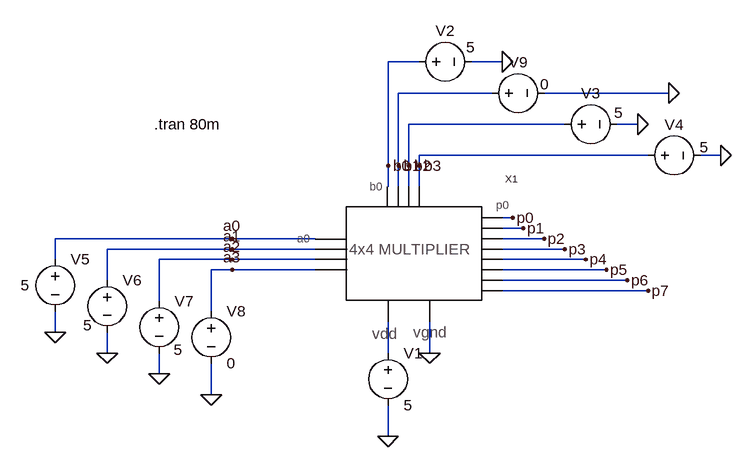
[diagram p0: schematic tb0111x1101.asc]
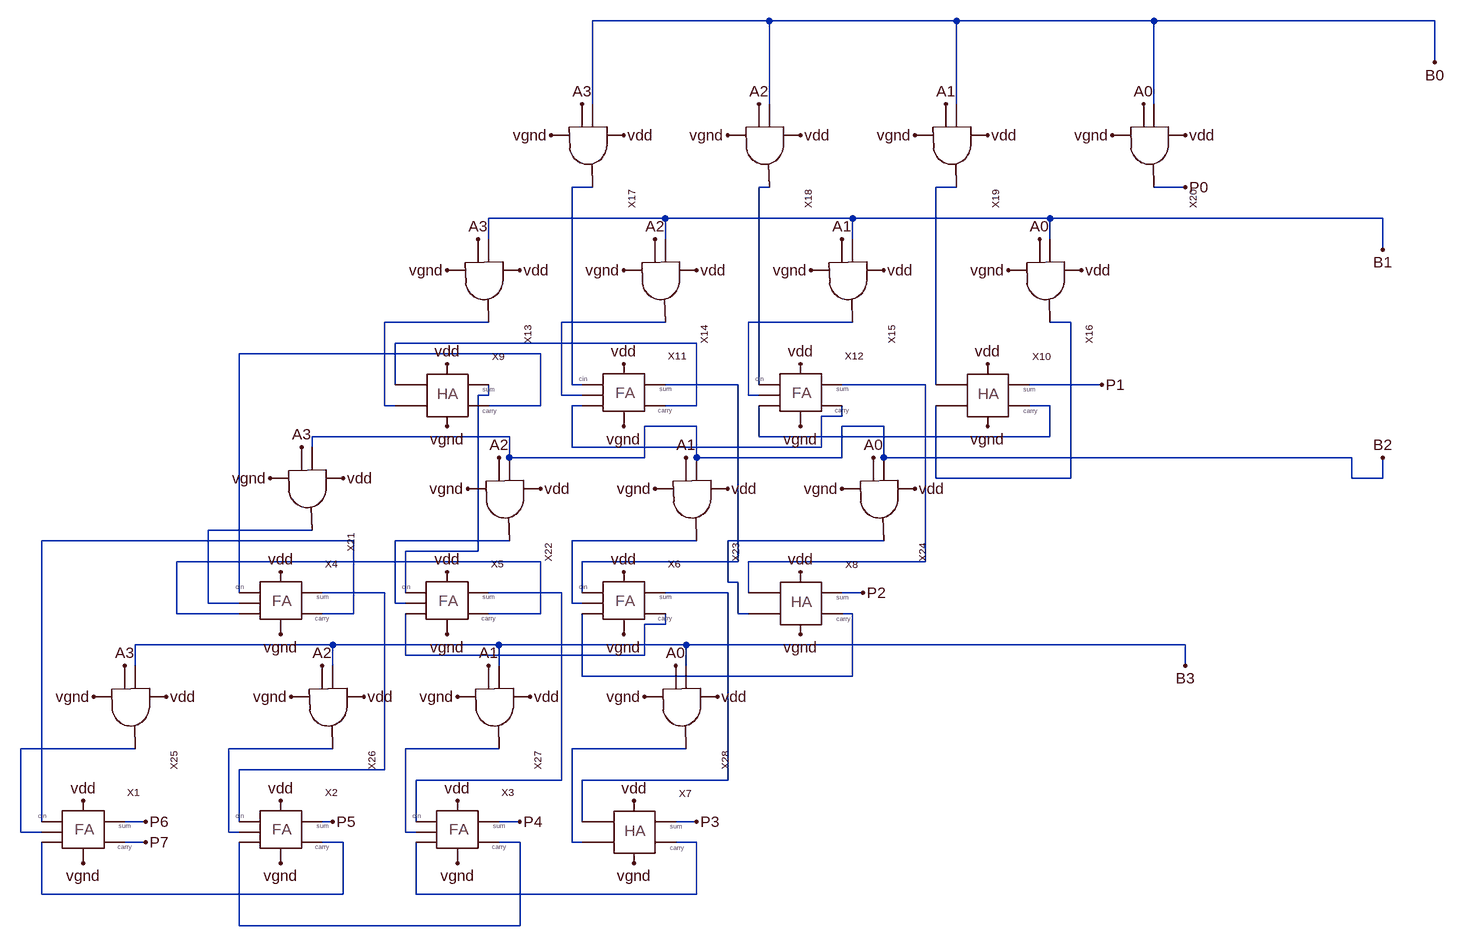
[diagram p1: sub-circuit array_multiplier.asc]
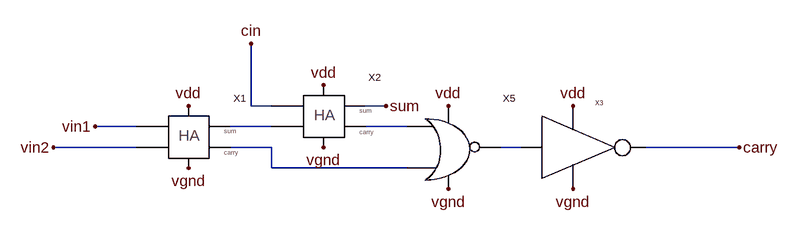
[diagram p2: sub-circuit fulladder.asc]
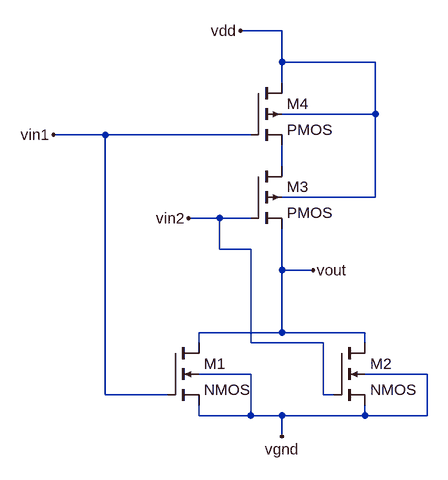
[diagram p3: sub-circuit cmos_nor.asc]
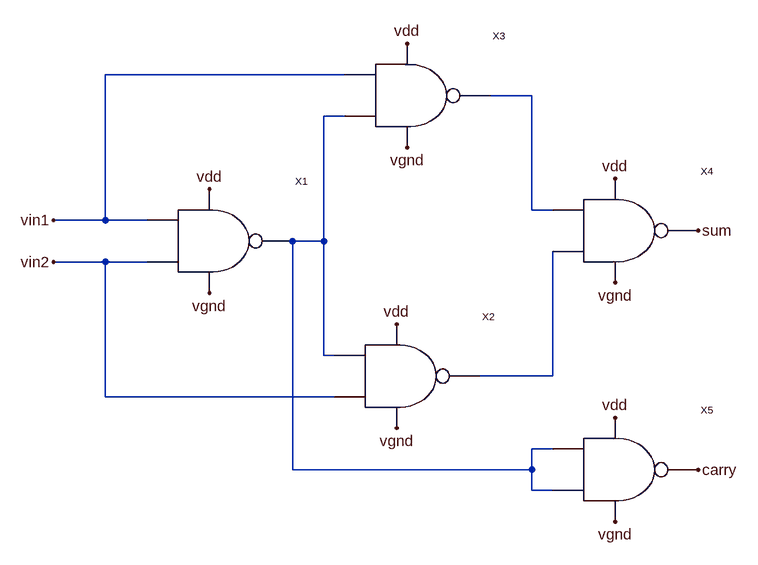
[diagram p4: sub-circuit halfadder.asc]
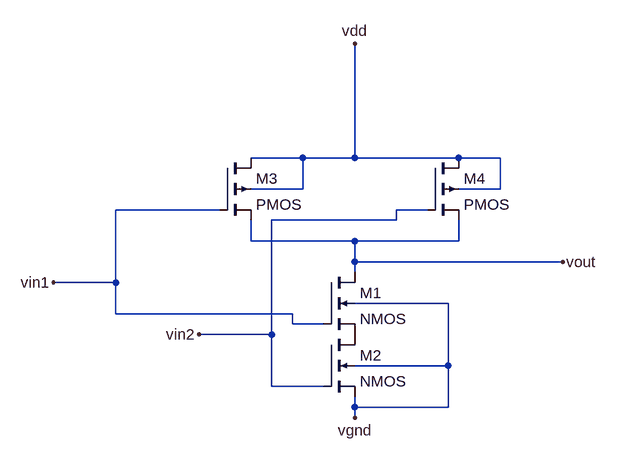
[diagram p5: sub-circuit cmos_nand.asc]
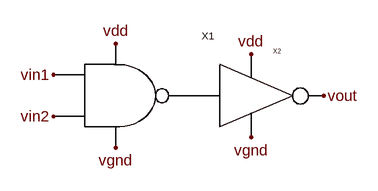
[diagram p6: sub-circuit cmos_and.asc]
tb0111x1101.asc, the LTspice schematic file:
Version 4
SHEET 1 880 680
WIRE 304 -176 256 -176
WIRE 432 -176 384 -176
WIRE 416 -128 272 -128
WIRE 688 -128 496 -128
WIRE 528 -80 288 -80
WIRE 640 -80 608 -80
WIRE 656 -32 304 -32
WIRE 768 -32 736 -32
WIRE 256 -16 256 -176
WIRE 272 -16 272 -128
WIRE 288 -16 288 -80
WIRE 304 -16 304 -32
WIRE 256 16 256 -16
WIRE 272 16 272 -16
WIRE 288 16 288 -16
WIRE 304 16 304 -16
WIRE 448 64 432 64
WIRE 464 80 432 80
WIRE 16 96 -256 96
WIRE 144 96 16 96
WIRE 496 96 432 96
WIRE 16 112 -176 112
WIRE 144 112 16 112
WIRE 528 112 432 112
WIRE -256 128 -256 96
WIRE 16 128 -96 128
WIRE 144 128 16 128
WIRE 560 128 432 128
WIRE 16 144 -16 144
WIRE 144 144 16 144
WIRE 592 144 432 144
WIRE -176 160 -176 112
WIRE 624 160 432 160
WIRE 656 176 432 176
WIRE -96 192 -96 128
WIRE -16 208 -16 144
WIRE -256 240 -256 208
WIRE -176 272 -176 240
WIRE 256 272 256 224
WIRE 320 272 320 224
WIRE -96 304 -96 272
WIRE -16 336 -16 288
WIRE 256 400 256 352
FLAG 448 64 p0
FLAG 496 96 p2
FLAG 464 80 p1
FLAG 528 112 p3
FLAG 560 128 p4
FLAG 592 144 p5
FLAG 656 176 p7
FLAG 624 160 p6
FLAG 432 -176 0
FLAG 640 -80 0
FLAG 768 -32 0
FLAG -256 240 0
FLAG -176 272 0
FLAG -96 304 0
FLAG 256 400 0
FLAG 320 272 0
FLAG 688 -128 0
FLAG -16 336 0
FLAG 16 96 a0
FLAG 16 112 a1
FLAG 16 128 a2
FLAG 16 144 a3
FLAG 256 -16 b0
FLAG 272 -16 b1
FLAG 288 -16 b2
FLAG 304 -16 b3
SYMBOL voltage 256 256 R0
WINDOW 123 0 0 Left 0
WINDOW 39 0 0 Left 0
SYMATTR InstName V1
SYMATTR Value 5
SYMBOL voltage 288 -176 R270
WINDOW 0 32 56 VTop 2
WINDOW 3 38 95 VBottom 2
WINDOW 123 0 0 Left 0
WINDOW 39 0 0 Left 0
SYMATTR InstName V2
SYMATTR Value 5
SYMBOL voltage 512 -80 R270
WINDOW 0 32 56 VTop 2
WINDOW 3 33 99 VBottom 2
WINDOW 123 0 0 Left 0
WINDOW 39 0 0 Left 0
SYMATTR InstName V3
SYMATTR Value 5
SYMBOL voltage 640 -32 R270
WINDOW 0 32 56 VTop 2
WINDOW 3 28 102 VBottom 2
WINDOW 123 0 0 Left 0
WINDOW 39 0 0 Left 0
SYMATTR InstName V4
SYMATTR Value 5
SYMBOL voltage -256 112 R0
WINDOW 3 -53 56 Left 2
WINDOW 123 0 0 Left 0
WINDOW 39 0 0 Left 0
SYMATTR Value 5
SYMATTR InstName V5
SYMBOL voltage -176 144 R0
WINDOW 3 -37 85 Left 2
WINDOW 123 0 0 Left 0
WINDOW 39 0 0 Left 0
SYMATTR Value 5
SYMATTR InstName V6
SYMBOL voltage -96 176 R0
WINDOW 3 22 91 Left 2
WINDOW 123 0 0 Left 0
WINDOW 39 0 0 Left 0
SYMATTR Value 5
SYMATTR InstName V7
SYMBOL array_multiplier 304 112 R0
SYMATTR InstName X1
SYMBOL voltage -16 192 R0
WINDOW 123 0 0 Left 0
WINDOW 39 0 0 Left 0
SYMATTR InstName V8
SYMATTR Value 0
SYMBOL voltage 400 -128 R270
WINDOW 0 32 56 VTop 2
WINDOW 3 29 97 VBottom 2
WINDOW 123 0 0 Left 0
WINDOW 39 0 0 Left 0
SYMATTR InstName V9
SYMATTR Value 0
TEXT -104 -80 Left 2 !.tran 80m

array_multiplier.asc, the sub-circuit schematic file:
Version 4
SHEET 1 2164 1384
WIRE 400 -544 128 -544
WIRE 688 -544 400 -544
WIRE 992 -544 688 -544
WIRE 1424 -544 992 -544
WIRE 1424 -480 1424 -544
WIRE 128 -416 128 -544
WIRE 400 -416 400 -544
WIRE 688 -416 688 -544
WIRE 992 -416 992 -544
WIRE 128 -288 96 -288
WIRE 400 -288 384 -288
WIRE 688 -288 656 -288
WIRE 1040 -288 992 -288
WIRE 240 -240 -32 -240
WIRE 528 -240 240 -240
WIRE 832 -240 528 -240
WIRE 1344 -240 832 -240
WIRE -32 -208 -32 -240
WIRE 240 -208 240 -240
WIRE 528 -208 528 -240
WIRE 832 -208 832 -240
WIRE 1344 -192 1344 -240
WIRE -32 -80 -192 -80
WIRE 240 -80 80 -80
WIRE 528 -80 368 -80
WIRE 864 -80 832 -80
WIRE 288 -48 -176 -48
WIRE 48 -32 -416 -32
WIRE -176 16 -176 -48
WIRE 96 16 96 -288
WIRE 112 16 96 16
WIRE 352 16 240 16
WIRE 384 16 384 -288
WIRE 640 16 512 16
WIRE 656 16 656 -288
WIRE 912 16 800 16
WIRE -32 32 -32 16
WIRE -32 32 -48 32
WIRE 80 32 80 -80
WIRE 112 32 80 32
WIRE 368 32 368 -80
WIRE 384 32 368 32
WIRE -192 48 -192 -80
WIRE -176 48 -192 48
WIRE 48 48 48 -32
WIRE 48 48 -32 48
WIRE 112 48 96 48
WIRE 288 48 288 -48
WIRE 288 48 240 48
WIRE 832 48 800 48
WIRE 512 64 512 48
WIRE 512 64 480 64
WIRE 288 80 208 80
WIRE 576 80 512 80
WIRE 0 96 -304 96
WIRE 384 96 384 48
WIRE 832 96 832 48
WIRE 832 96 384 96
WIRE -304 112 -304 96
WIRE 96 112 96 48
WIRE 480 112 480 64
WIRE 480 112 96 112
WIRE 0 128 0 96
WIRE 208 128 208 80
WIRE 208 128 0 128
WIRE 288 128 288 80
WIRE 512 128 512 80
WIRE 512 128 288 128
WIRE 576 128 576 80
WIRE 1296 128 576 128
WIRE 656 160 656 48
WIRE 864 160 864 -80
WIRE 864 160 656 160
WIRE 1296 160 1296 128
WIRE 1344 160 1344 128
WIRE 1344 160 1296 160
WIRE -304 240 -464 240
WIRE -240 256 -720 256
WIRE 0 256 -176 256
WIRE 288 256 96 256
WIRE 576 256 336 256
WIRE -48 272 -48 32
WIRE -48 272 -160 272
WIRE 48 288 -512 288
WIRE 352 288 352 16
WIRE 352 288 112 288
WIRE 640 288 640 16
WIRE 640 288 368 288
WIRE 336 320 336 256
WIRE 352 320 336 320
WIRE -416 336 -416 -32
WIRE -192 336 -288 336
WIRE -160 336 -160 272
WIRE 80 336 -32 336
WIRE 112 336 112 288
WIRE 336 336 240 336
WIRE 368 336 368 288
WIRE 544 336 512 336
WIRE -464 352 -464 240
WIRE -416 352 -464 352
WIRE -176 352 -176 256
WIRE -160 352 -176 352
WIRE 96 352 96 256
WIRE 112 352 96 352
WIRE -512 368 -512 288
WIRE -416 368 -512 368
WIRE -240 368 -240 256
WIRE -240 368 -288 368
WIRE 48 368 48 288
WIRE 48 368 -32 368
WIRE 352 368 352 320
WIRE 368 368 352 368
WIRE 528 368 512 368
WIRE 240 384 240 368
WIRE 240 384 208 384
WIRE -272 416 -576 416
WIRE -16 416 -272 416
WIRE 272 416 -16 416
WIRE 1040 416 272 416
WIRE -160 432 -160 368
WIRE 208 432 208 384
WIRE 208 432 -160 432
WIRE -576 448 -576 416
WIRE -272 448 -272 416
WIRE -16 448 -16 416
WIRE 272 448 272 416
WIRE 1040 448 1040 416
WIRE 112 464 112 368
WIRE 528 464 528 368
WIRE 528 464 112 464
WIRE -576 576 -752 576
WIRE -272 576 -432 576
WIRE -16 576 -160 576
WIRE 272 576 96 576
WIRE -192 608 -192 336
WIRE -192 608 -416 608
WIRE 80 624 80 336
WIRE 80 624 -144 624
WIRE 336 624 336 336
WIRE 336 624 112 624
WIRE -720 688 -720 256
WIRE -560 688 -592 688
WIRE -416 688 -416 608
WIRE -272 688 -288 688
WIRE -144 688 -144 624
WIRE 16 688 -16 688
WIRE 112 688 112 624
WIRE 288 688 256 688
WIRE -752 704 -752 576
WIRE -720 704 -752 704
WIRE -432 704 -432 576
WIRE -416 704 -432 704
WIRE -160 704 -160 576
WIRE -144 704 -160 704
WIRE -560 720 -592 720
WIRE -256 720 -288 720
WIRE 16 720 -16 720
WIRE 96 720 96 576
WIRE 112 720 96 720
WIRE 288 720 256 720
WIRE -720 800 -720 720
WIRE -256 800 -256 720
WIRE -256 800 -720 800
WIRE -144 800 -144 720
WIRE 288 800 288 720
WIRE 288 800 -144 800
WIRE -416 848 -416 720
WIRE 16 848 16 720
WIRE 16 848 -416 848
FLAG 112 -416 A3
FLAG 384 -416 A2
FLAG 672 -416 A1
FLAG 976 -416 A0
FLAG 816 -208 A0
FLAG 560 128 A0
FLAG 256 448 A0
FLAG 512 -208 A1
FLAG 272 128 A1
FLAG -32 448 A1
FLAG 224 -208 A2
FLAG -16 128 A2
FLAG -288 448 A2
FLAG -48 -208 A3
FLAG -320 112 A3
FLAG -592 448 A3
FLAG 1424 -480 B0
FLAG 1344 -192 B1
FLAG 1344 128 B2
FLAG 1040 448 B3
FLAG 1040 -288 P0
FLAG 912 16 P1
FLAG 544 336 P2
FLAG -560 720 P7
FLAG -560 688 P6
FLAG -272 688 P5
FLAG 16 688 P4
FLAG 288 688 P3
FLAG -96 -16 vdd
FLAG 176 -16 vdd
FLAG 448 -16 vdd
FLAG 736 -16 vdd
FLAG -256 160 vdd
FLAG 48 176 vdd
FLAG 336 176 vdd
FLAG 624 176 vdd
FLAG 448 304 vdd
FLAG 176 304 vdd
FLAG -352 304 vdd
FLAG -528 496 vdd
FLAG -224 496 vdd
FLAG 32 496 vdd
FLAG 320 496 vdd
FLAG 192 656 vdd
FLAG -80 656 vdd
FLAG -352 656 vdd
FLAG -656 656 vdd
FLAG -96 80 vgnd
FLAG 176 80 vgnd
FLAG 448 80 vgnd
FLAG 736 80 vgnd
FLAG 512 176 vgnd
FLAG 224 176 vgnd
FLAG -64 176 vgnd
FLAG -368 160 vgnd
FLAG -352 400 vgnd
FLAG -96 400 vgnd
FLAG 176 400 vgnd
FLAG 448 400 vgnd
FLAG 208 496 vgnd
FLAG -80 496 vgnd
FLAG -336 496 vgnd
FLAG -640 496 vgnd
FLAG -656 752 vgnd
FLAG -352 752 vgnd
FLAG -80 752 vgnd
FLAG 192 752 vgnd
FLAG 176 -368 vdd
FLAG 448 -368 vdd
FLAG 736 -368 vdd
FLAG 1040 -368 vdd
FLAG 880 -160 vdd
FLAG 576 -160 vdd
FLAG 288 -160 vdd
FLAG 16 -160 vdd
FLAG -96 304 vdd
FLAG -96 -160 vgnd
FLAG 176 -160 vgnd
FLAG 464 -160 vgnd
FLAG 768 -160 vgnd
FLAG 624 -368 vgnd
FLAG 336 -368 vgnd
FLAG 64 -368 vgnd
FLAG 928 -368 vgnd
SYMBOL fulladder -656 704 R0
SYMATTR InstName X1
SYMBOL fulladder -352 704 R0
SYMATTR InstName X2
SYMBOL fulladder -80 704 R0
SYMATTR InstName X3
SYMBOL fulladder -352 352 R0
SYMATTR InstName X4
SYMBOL fulladder -96 352 R0
SYMATTR InstName X5
SYMBOL fulladder 176 352 R0
SYMATTR InstName X6
SYMBOL halfadder 192 704 R0
SYMATTR InstName X7
SYMBOL halfadder 448 352 R0
SYMATTR InstName X8
SYMBOL halfadder -96 32 R0
SYMATTR InstName X9
SYMBOL halfadder 736 32 R0
SYMATTR InstName X10
SYMBOL fulladder 176 32 R0
SYMATTR InstName X11
SYMBOL fulladder 448 32 R0
SYMATTR InstName X12
SYMBOL cmos_and -48 -144 R90
SYMATTR InstName X13
SYMBOL cmos_and 224 -144 R90
SYMATTR InstName X14
SYMBOL cmos_and 512 -144 R90
SYMATTR InstName X15
SYMBOL cmos_and 816 -144 R90
SYMATTR InstName X16
SYMBOL cmos_and 112 -352 R90
SYMATTR InstName X17
SYMBOL cmos_and 384 -352 R90
SYMATTR InstName X18
SYMBOL cmos_and 672 -352 R90
SYMATTR InstName X19
SYMBOL cmos_and 976 -352 R90
SYMATTR InstName X20
SYMBOL cmos_and -320 176 R90
SYMATTR InstName X21
SYMBOL cmos_and -16 192 R90
SYMATTR InstName X22
SYMBOL cmos_and 272 192 R90
SYMATTR InstName X23
SYMBOL cmos_and 560 192 R90
SYMATTR InstName X24
SYMBOL cmos_and -592 512 R90
SYMATTR InstName X25
SYMBOL cmos_and -288 512 R90
SYMATTR InstName X26
SYMBOL cmos_and -32 512 R90
SYMATTR InstName X27
SYMBOL cmos_and 256 512 R90
SYMATTR InstName X28

fulladder.asc, the sub-circuit schematic file:
Version 4
SHEET 1 1084 680
WIRE 176 128 176 32
WIRE 208 128 176 128
WIRE 384 128 352 128
WIRE 0 160 -64 160
WIRE 208 160 144 160
WIRE 416 160 352 160
WIRE 0 192 -128 192
WIRE 208 192 144 192
WIRE 592 192 560 192
WIRE 928 192 784 192
WIRE 208 224 208 192
WIRE 416 224 208 224
FLAG 928 192 carry
FLAG 384 128 sum
FLAG -64 160 vin1
FLAG -128 192 vin2
FLAG 176 32 cin
FLAG 288 96 vdd
FLAG 80 128 vdd
FLAG 672 128 vdd
FLAG 480 128 vdd
FLAG 80 224 vgnd
FLAG 288 192 vgnd
FLAG 480 256 vgnd
FLAG 672 256 vgnd
SYMBOL cmos_nor 480 208 R0
SYMATTR InstName X5
SYMBOL halfadder 80 176 R0
SYMATTR InstName X1
SYMBOL halfadder 288 144 R0
SYMATTR InstName X2
SYMBOL inverter 672 192 R0
SYMATTR InstName X3

cmos_nor.asc, the sub-circuit schematic file:
Version 4
SHEET 1 1312 712
WIRE 976 -16 912 -16
WIRE 976 32 976 -16
WIRE 1120 32 976 32
WIRE 976 64 976 32
WIRE 1120 112 1120 32
WIRE 1120 112 976 112
WIRE 704 144 624 144
WIRE 928 144 704 144
WIRE 976 192 976 160
WIRE 1120 240 1120 112
WIRE 1120 240 976 240
WIRE 880 272 832 272
WIRE 928 272 880 272
WIRE 880 320 880 272
WIRE 928 320 880 320
WIRE 976 352 976 288
WIRE 1024 352 976 352
WIRE 976 448 976 352
WIRE 976 448 848 448
WIRE 1104 448 976 448
WIRE 848 464 848 448
WIRE 928 464 928 320
WIRE 1040 464 928 464
WIRE 1104 464 1104 448
WIRE 928 512 848 512
WIRE 1200 512 1104 512
WIRE 704 544 704 144
WIRE 800 544 704 544
WIRE 1040 544 1040 464
WIRE 1056 544 1040 544
WIRE 848 576 848 560
WIRE 928 576 928 512
WIRE 928 576 848 576
WIRE 976 576 928 576
WIRE 1104 576 1104 560
WIRE 1104 576 976 576
WIRE 1200 576 1200 512
WIRE 1200 576 1104 576
WIRE 976 608 976 576
FLAG 912 -16 vdd
FLAG 624 144 vin1
FLAG 976 608 vgnd
FLAG 1024 352 vout
FLAG 832 272 vin2
SYMBOL nmos4 800 464 R0
SYMATTR InstName M1
SYMBOL nmos4 1056 464 R0
SYMATTR InstName M2
SYMBOL pmos4 928 192 R0
SYMATTR InstName M3
SYMBOL pmos4 928 64 R0
SYMATTR InstName M4

halfadder.asc, the sub-circuit schematic file:
Version 4
SHEET 1 924 680
WIRE 304 -128 -64 -128
WIRE 592 -96 528 -96
WIRE 304 -64 272 -64
WIRE 592 80 592 -96
WIRE 624 80 592 80
WIRE -64 96 -64 -128
WIRE -64 96 -144 96
WIRE 0 96 -64 96
WIRE 272 128 272 -64
WIRE 272 128 224 128
WIRE -64 160 -144 160
WIRE 0 160 -64 160
WIRE 272 304 272 128
WIRE 288 304 272 304
WIRE 624 336 624 144
WIRE 624 336 512 336
WIRE -64 368 -64 160
WIRE 288 368 -64 368
WIRE 624 448 592 448
WIRE 224 480 224 128
WIRE 592 480 592 448
WIRE 592 480 224 480
WIRE 592 512 592 480
WIRE 624 512 592 512
FLAG 400 -176 vdd
FLAG 400 -16 vgnd
FLAG 96 48 vdd
FLAG 96 208 vgnd
FLAG 384 256 vdd
FLAG 384 416 vgnd
FLAG 720 192 vgnd
FLAG 720 32 vdd
FLAG 848 112 sum
FLAG 848 480 carry
FLAG 720 400 vdd
FLAG 720 560 vgnd
FLAG -144 96 vin1
FLAG -144 160 vin2
SYMBOL cmos_nand 96 128 R0
SYMATTR InstName X1
SYMBOL cmos_nand 384 336 R0
SYMATTR InstName X2
SYMBOL cmos_nand 400 -96 R0
SYMATTR InstName X3
SYMBOL cmos_nand 720 112 R0
SYMATTR InstName X4
SYMBOL cmos_nand 720 480 R0
SYMATTR InstName X5

cmos_nand.asc, the sub-circuit schematic file:
Version 4
SHEET 1 880 680
WIRE 112 -96 32 -96
WIRE 192 -96 192 -272
WIRE 192 -96 112 -96
WIRE 352 -96 192 -96
WIRE 416 -96 352 -96
WIRE 112 -48 112 -96
WIRE 112 -48 32 -48
WIRE 416 -48 416 -96
WIRE 416 -48 352 -48
WIRE -16 -16 -176 -16
WIRE 304 -16 256 -16
WIRE 256 0 256 -16
WIRE 256 0 64 0
WIRE 32 32 32 0
WIRE 192 32 32 32
WIRE 352 32 352 0
WIRE 352 32 192 32
WIRE 192 64 192 32
WIRE 512 64 192 64
WIRE 192 80 192 64
WIRE -176 96 -176 -16
WIRE -176 96 -272 96
WIRE 336 128 192 128
WIRE -176 144 -176 96
WIRE 96 144 -176 144
WIRE 96 160 96 144
WIRE 144 160 96 160
WIRE 64 176 64 0
WIRE 64 176 -48 176
WIRE 336 224 336 128
WIRE 336 224 192 224
WIRE 64 256 64 176
WIRE 144 256 64 256
WIRE 192 288 192 272
WIRE 336 288 336 224
WIRE 336 288 192 288
WIRE 192 304 192 288
FLAG 512 64 vout
FLAG 192 -272 vdd
FLAG -272 96 vin1
FLAG -48 176 vin2
FLAG 192 304 vgnd
SYMBOL nmos4 144 80 R0
SYMATTR InstName M1
SYMBOL nmos4 144 176 R0
SYMATTR InstName M2
SYMBOL pmos4 -16 -96 R0
SYMATTR InstName M3
SYMBOL pmos4 304 -96 R0
SYMATTR InstName M4

cmos_and.asc, the sub-circuit schematic file:
Version 4
SHEET 1 880 680
FLAG 16 128 vin1
FLAG 16 192 vin2
FLAG 112 80 vdd
FLAG 112 240 vgnd
FLAG 320 96 vdd
FLAG 320 224 vgnd
FLAG 432 160 vout
SYMBOL cmos_nand 112 160 R0
SYMATTR InstName X1
SYMBOL inverter 320 160 R0
SYMATTR InstName X2

The netlist it stands for:
* tb0111x1101.asc
V1 N001 0 5
V2 b0 0 5
V3 b2 0 5
V4 b3 0 5
V5 a0 0 5
V6 a1 0 5
V7 a2 0 5
XX1 a0 a1 a2 a3 p0 p1 p2 p3 b0 b1 b2 b3 p4 p5 p6 p7 N001 0 array_multiplier
V8 a3 0 0
V9 b1 0 0

* block symbol definitions
.subckt array_multiplier a0 a1 a2 a3 p0 p1 p2 p3 b0 b1 b2 b3 p4 p5 p6 p7 vdd vgnd
XX1 N016 N030 vgnd vdd P6 P7 N026 fulladder
XX2 N021 N031 vgnd vdd P5 N030 N027 fulladder
XX3 N022 N032 vgnd vdd P4 N031 N028 fulladder
XX4 N009 N020 vgnd vdd N021 N016 N015 fulladder
XX5 N012 N025 vgnd vdd N022 N020 N017 fulladder
XX6 N010 N024 vgnd vdd N023 N025 N018 fulladder
XX7 N023 N029 P3 N032 vdd vgnd halfadder
XX8 N011 N019 P2 N024 vdd vgnd halfadder
XX9 N008 N004 N012 N009 vdd vgnd halfadder
XX10 N003 N007 P1 N014 vdd vgnd halfadder
XX11 N001 N013 vgnd vdd N010 N008 N005 fulladder
XX12 N002 N014 vgnd vdd N011 N013 N006 fulladder
XX13 B1 A3 vdd vgnd N004 cmos_and
XX14 B1 A2 vdd vgnd N005 cmos_and
XX15 B1 A1 vdd vgnd N006 cmos_and
XX16 B1 A0 vdd vgnd N007 cmos_and
XX17 B0 A3 vdd vgnd N001 cmos_and
XX18 B0 A2 vdd vgnd N002 cmos_and
XX19 B0 A1 vdd vgnd N003 cmos_and
XX20 B0 A0 vdd vgnd P0 cmos_and
XX21 B2 A3 vdd vgnd N015 cmos_and
XX22 B2 A2 vdd vgnd N017 cmos_and
XX23 B2 A1 vdd vgnd N018 cmos_and
XX24 B2 A0 vdd vgnd N019 cmos_and
XX25 B3 A3 vdd vgnd N026 cmos_and
XX26 B3 A2 vdd vgnd N027 cmos_and
XX27 B3 A1 vdd vgnd N028 cmos_and
XX28 B3 A0 vdd vgnd N029 cmos_and
.ends array_multiplier

.subckt fulladder cin vin2 vgnd vdd sum carry vin1
XX5 vdd vgnd N002 N003 N004 cmos_nor
XX1 vin1 vin2 N001 N003 vdd vgnd halfadder
XX2 cin N001 sum N002 vdd vgnd halfadder
XX3 N004 vdd vgnd carry inverter  ; pins vin vdd vg vout
.ends fulladder

.subckt cmos_nor vdd vgnd vin1 vin2 vout
M1 vout vin1 vgnd vgnd NMOS
M2 vout vin2 vgnd vgnd NMOS
M3 N001 vin2 vout vdd PMOS
M4 vdd vin1 N001 vdd PMOS
.ends cmos_nor

.subckt halfadder vin1 vin2 sum carry vdd vgnd
XX1 vin1 vin2 N002 vdd vgnd cmos_nand
XX2 N002 vin2 N003 vdd vgnd cmos_nand
XX3 vin1 N002 N001 vdd vgnd cmos_nand
XX4 N001 N003 sum vdd vgnd cmos_nand
XX5 N002 N002 carry vdd vgnd cmos_nand
.ends halfadder

.subckt cmos_nand vin1 vin2 vout vdd vgnd
M1 vout vin1 P001 vgnd NMOS
M2 P001 vin2 vgnd vgnd NMOS
M3 vdd vin1 vout vdd PMOS
M4 vdd vin2 vout vdd PMOS
.ends cmos_nand

.subckt cmos_and vin1 vin2 vdd vgnd vout
XX1 vin1 vin2 P001 vdd vgnd cmos_nand
XX2 P001 vdd vgnd vout inverter  ; pins vin vdd vg vout
.ends cmos_and

.model NMOS NMOS
.model PMOS PMOS
.lib standard.mos
.tran 80m
.backanno
.end